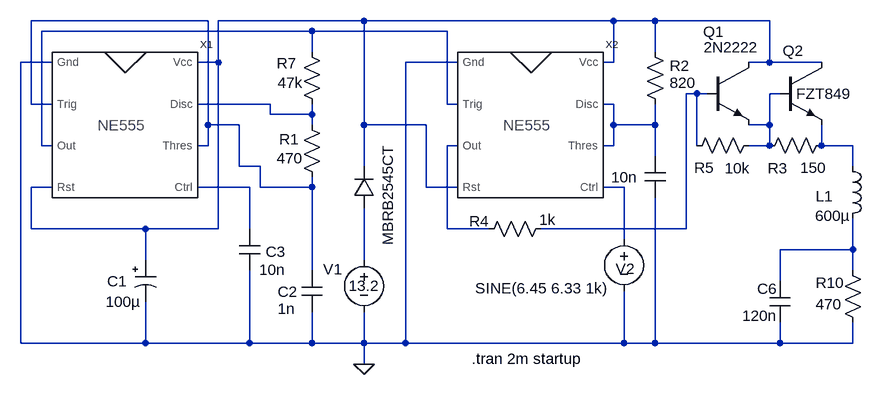
[diagram p0: schematic PwmNe555Jerarq.asc]
PwmNe555Jerarq.asc, the LTspice schematic file:
Version 4
SHEET 1 880 680
WIRE -752 384 -752 -48
WIRE -736 16 -736 -112
WIRE -736 208 -736 144
WIRE -720 80 -720 -96
WIRE -704 -48 -752 -48
WIRE -704 16 -736 16
WIRE -704 80 -720 80
WIRE -704 144 -736 144
WIRE -560 208 -736 208
WIRE -560 256 -560 208
WIRE -560 384 -752 384
WIRE -560 384 -560 320
WIRE -464 -112 -736 -112
WIRE -464 48 -464 -112
WIRE -464 80 -480 80
WIRE -464 80 -464 48
WIRE -448 -48 -480 -48
WIRE -448 -48 -448 -112
WIRE -448 208 -560 208
WIRE -448 208 -448 -48
WIRE -416 48 -464 48
WIRE -416 112 -416 48
WIRE -400 144 -480 144
WIRE -400 208 -400 144
WIRE -400 384 -560 384
WIRE -400 384 -400 272
WIRE -384 112 -416 112
WIRE -384 144 -384 112
WIRE -368 16 -480 16
WIRE -368 32 -368 16
WIRE -304 -96 -720 -96
WIRE -304 -64 -304 -96
WIRE -304 32 -368 32
WIRE -304 32 -304 16
WIRE -304 48 -304 32
WIRE -304 144 -384 144
WIRE -304 144 -304 128
WIRE -304 272 -304 144
WIRE -304 384 -400 384
WIRE -304 384 -304 336
WIRE -224 -112 -448 -112
WIRE -224 48 -224 -112
WIRE -224 112 -224 48
WIRE -224 256 -224 176
WIRE -224 384 -304 384
WIRE -224 384 -224 336
WIRE -224 416 -224 384
WIRE -160 384 -224 384
WIRE -160 384 -160 -48
WIRE -128 48 -224 48
WIRE -128 144 -128 48
WIRE -96 -96 -304 -96
WIRE -96 16 -96 -96
WIRE -96 208 -96 80
WIRE -80 -48 -160 -48
WIRE -80 16 -96 16
WIRE -80 80 -96 80
WIRE -80 144 -128 144
WIRE -32 208 -96 208
WIRE 160 -112 -224 -112
WIRE 160 -48 144 -48
WIRE 160 -48 160 -112
WIRE 160 16 144 16
WIRE 160 48 160 16
WIRE 160 80 144 80
WIRE 160 80 160 48
WIRE 176 144 144 144
WIRE 176 224 176 144
WIRE 176 384 -160 384
WIRE 176 384 176 304
WIRE 224 -112 160 -112
WIRE 224 -64 224 -112
WIRE 224 48 160 48
WIRE 224 48 224 16
WIRE 224 96 224 48
WIRE 224 384 176 384
WIRE 224 384 224 160
WIRE 272 208 48 208
WIRE 272 208 272 0
WIRE 288 0 272 0
WIRE 288 80 288 0
WIRE 304 0 288 0
WIRE 400 -112 224 -112
WIRE 400 -48 368 -48
WIRE 400 -48 400 -112
WIRE 400 48 368 48
WIRE 400 48 400 0
WIRE 400 80 368 80
WIRE 400 80 400 48
WIRE 416 0 400 0
WIRE 416 288 416 240
WIRE 416 384 224 384
WIRE 416 384 416 352
WIRE 480 -48 400 -48
WIRE 480 80 480 48
WIRE 528 80 480 80
WIRE 528 112 528 80
WIRE 528 240 416 240
WIRE 528 240 528 192
WIRE 528 272 528 240
WIRE 528 384 416 384
WIRE 528 384 528 352
FLAG -224 416 0
SYMBOL polcap -576 256 R0
WINDOW 0 -12 33 Right 0
WINDOW 3 9 64 Right 0
SYMATTR InstName C1
SYMATTR Value 100µ
SYMATTR Description Capacitor
SYMATTR Type cap
SYMATTR SpiceLine V=16 Irms=1.436 Rser=0.08 MTBF=0 Lser=2.5p mfg="KEMET" pn="T495X107K016AS4823" type="Tantalum" ppPkg=1
SYMBOL cap -320 272 R0
WINDOW 0 -6 33 Right 0
WINDOW 3 -10 59 Right 0
SYMATTR InstName C2
SYMATTR Value 1n
SYMBOL diode -240 176 M180
WINDOW 0 24 72 Invisible 0
WINDOW 3 53 97 VLeft 0
SYMATTR InstName D1
SYMATTR Value MBRB2545CT
SYMBOL res -320 32 R0
WINDOW 0 -19 23 Top 0
WINDOW 3 -18 52 Top 0
SYMATTR InstName R1
SYMATTR Value 470
SYMATTR SpiceLine tol=1 pwr=0.1
SYMBOL voltage -224 240 M0
WINDOW 0 48 15 Top 0
WINDOW 3 0 71 Bottom 0
SYMATTR InstName V1
SYMATTR Value 13.2
SYMATTR Value2 AC 1
SYMATTR SpiceLine Rser=.001
SYMBOL res -288 32 R180
WINDOW 0 70 79 Right 0
WINDOW 3 69 49 Right 0
SYMATTR InstName R7
SYMATTR Value 47k
SYMATTR SpiceLine tol=1 pwr=0.1
SYMBOL cap -416 208 R0
WINDOW 0 41 35 Left 0
WINDOW 3 31 63 Left 0
SYMATTR InstName C3
SYMATTR Value 10n
SYMBOL cap 208 96 R0
WINDOW 0 24 8 Invisible 0
WINDOW 3 -11 33 Right 0
SYMATTR InstName C4
SYMATTR Value 10n
SYMBOL res 240 32 R180
WINDOW 0 -6 75 Right 0
WINDOW 3 -6 49 Right 0
SYMATTR InstName R2
SYMATTR Value 820
SYMATTR SpiceLine tol=1 pwr=0.1
SYMBOL voltage 176 208 M0
WINDOW 0 -2 46 Top 0
WINDOW 3 126 107 Bottom 0
WINDOW 123 0 0 Left 0
SYMATTR InstName V2
SYMATTR Value SINE(6.45 6.33 1k)
SYMATTR SpiceLine Rser=1
SYMBOL res 64 192 R90
WINDOW 0 4 95 VRight 0
WINDOW 3 2 -7 VRight 0
SYMATTR InstName R4
SYMATTR Value 1k
SYMATTR SpiceLine tol=1 pwr=0.1
SYMBOL cap 400 288 R0
WINDOW 0 -19 12 Left 0
WINDOW 3 -42 54 Left 0
SYMATTR InstName C6
SYMATTR Value 120n
SYMBOL npn3 304 -48 R0
WINDOW 0 -6 -47 Left 0
WINDOW 3 -5 -23 Left 0
SYMATTR InstName Q1
SYMATTR Value 2N2222
SYMBOL npn3 416 -48 R0
WINDOW 0 4 -18 Left 0
WINDOW 3 25 48 Left 0
SYMATTR InstName Q2
SYMATTR Value FZT849
SYMBOL res 496 64 R90
WINDOW 0 51 68 VRight 0
WINDOW 3 50 8 VRight 0
SYMATTR InstName R3
SYMATTR Value 150
SYMATTR SpiceLine tol=1 pwr=0.1
SYMBOL res 384 64 R90
WINDOW 0 50 69 VRight 0
WINDOW 3 51 14 VRight 0
SYMATTR InstName R5
SYMATTR Value 10k
SYMATTR SpiceLine tol=1 pwr=0.1
SYMBOL ind 512 96 R0
WINDOW 0 -41 62 Left 0
WINDOW 3 -42 92 Left 0
SYMATTR InstName L1
SYMATTR Value 600µ
SYMBOL res 512 256 R0
WINDOW 0 -41 35 Left 0
WINDOW 3 -41 68 Left 0
SYMATTR InstName R10
SYMATTR Value 470
SYMBOL ne555 -544 64 R0
SYMATTR InstName X1
SYMBOL ne555 80 64 R0
SYMATTR InstName X2
TEXT -58 408 Left 0 !.tran 2m startup

The netlist it stands for:
* PwmNe555Jerarq.asc
C1 N002 0 100µ V=16 Irms=1.436 Rser=0.08 MTBF=0 Lser=2.5p mfg="KEMET" pn="T495X107K016AS4823" type="Tantalum" ppPkg=1
C2 N001 0 1n
D1 N006 N002 MBRB2545CT
R1 N005 N001 470 tol=1 pwr=0.1
V1 N006 0 13.2 AC 1 Rser=.001
R7 N005 N003 47k tol=1 pwr=0.1
C3 N004 0 10n
C4 N008 0 10n
R2 N008 N002 820 tol=1 pwr=0.1
V2 N009 0 SINE(6.45 6.33 1k) Rser=1
R4 N010 N007 1k tol=1 pwr=0.1
C6 N012 0 120n
Q1 N002 N010 N011 0 2N2222
Q2 N002 N011 N013 0 FZT849
R3 N013 N011 150 tol=1 pwr=0.1
R5 N011 N010 10k tol=1 pwr=0.1
L1 N013 N012 600µ
R10 N012 0 470
XX1 0 N001 N003 N002 N004 N001 N005 N002 ne555  ; pins Gnd Trig Out Rst Ctrl Thres Disc Vcc
XX2 0 N003 N007 N002 N009 N008 N008 N002 ne555  ; pins Gnd Trig Out Rst Ctrl Thres Disc Vcc
.model D D
.lib standard.dio
.model NPN NPN
.model PNP PNP
.lib standard.bjt
.tran 2m startup
.backanno
.end